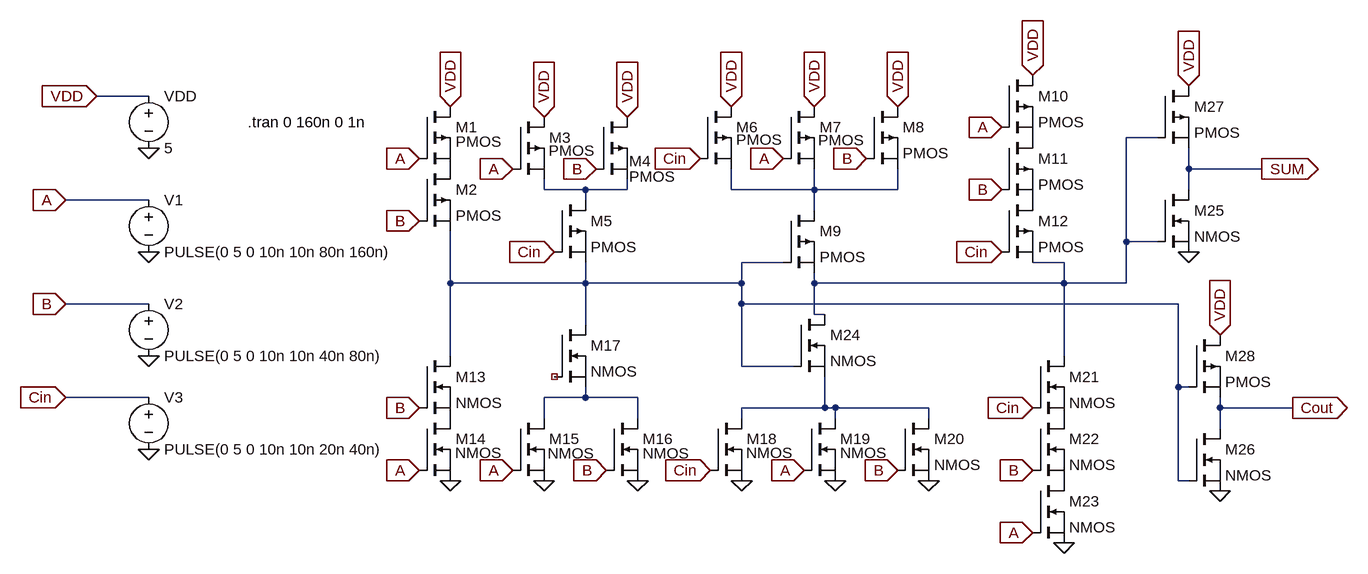
[diagram p0: schematic full add.asc]
full add.asc, the LTspice schematic file:
Version 4.1
SHEET 1 1360 808
WIRE -512 64 -592 64
WIRE 1040 128 992 128
WIRE 1088 176 1088 144
WIRE 1200 176 1088 176
WIRE 96 208 96 192
WIRE 160 208 96 208
WIRE 224 208 224 192
WIRE 224 208 160 208
WIRE 384 208 384 176
WIRE 512 208 512 176
WIRE 512 208 384 208
WIRE 640 208 640 176
WIRE 640 208 512 208
WIRE 1088 208 1088 176
WIRE -512 224 -640 224
WIRE 160 224 160 208
WIRE 512 240 512 208
WIRE 992 288 992 128
WIRE 1040 288 992 288
WIRE 464 320 400 320
WIRE 896 320 848 320
WIRE -48 352 -48 272
WIRE 160 352 160 320
WIRE 160 352 -48 352
WIRE 400 352 400 320
WIRE 400 352 160 352
WIRE 512 352 512 336
WIRE 896 352 896 320
WIRE 896 352 512 352
WIRE 992 352 992 288
WIRE 992 352 896 352
WIRE -512 384 -640 384
WIRE 400 384 400 352
WIRE 1072 384 400 384
WIRE 512 400 512 352
WIRE 528 400 512 400
WIRE 160 416 160 352
WIRE -48 464 -48 352
WIRE 896 464 896 352
WIRE 400 480 400 384
WIRE 480 480 400 480
WIRE 1072 512 1072 384
WIRE 1088 512 1072 512
WIRE -512 528 -640 528
WIRE 160 528 160 512
WIRE 160 528 96 528
WIRE 240 528 160 528
WIRE 528 544 528 496
WIRE 528 544 400 544
WIRE 544 544 528 544
WIRE 688 544 544 544
WIRE 1136 544 1136 528
WIRE 1248 544 1136 544
WIRE 96 560 96 528
WIRE 240 560 240 528
WIRE 400 560 400 544
WIRE 544 560 544 544
WIRE 688 560 688 544
WIRE 1136 576 1136 544
WIRE 1072 656 1072 512
WIRE 1088 656 1072 656
FLAG -592 64 VDD
IOPIN -592 64 In
FLAG -48 80 VDD
IOPIN -48 80 In
FLAG 96 96 VDD
IOPIN 96 96 In
FLAG 224 96 VDD
IOPIN 224 96 In
FLAG 384 80 VDD
IOPIN 384 80 In
FLAG 512 80 VDD
IOPIN 512 80 In
FLAG 640 80 VDD
IOPIN 640 80 In
FLAG 848 32 VDD
IOPIN 848 32 In
FLAG -640 224 A
IOPIN -640 224 In
FLAG -96 160 A
IOPIN -96 160 In
FLAG 48 176 A
IOPIN 48 176 In
FLAG 800 112 A
IOPIN 800 112 In
FLAG 464 160 A
IOPIN 464 160 In
FLAG -96 640 A
IOPIN -96 640 In
FLAG 48 640 A
IOPIN 48 640 In
FLAG 496 640 A
IOPIN 496 640 In
FLAG 848 736 A
IOPIN 848 736 In
FLAG -640 384 B
IOPIN -640 384 In
FLAG -96 256 B
IOPIN -96 256 In
FLAG -96 544 B
IOPIN -96 544 In
FLAG 176 176 B
IOPIN 176 176 In
FLAG 592 160 B
IOPIN 592 160 In
FLAG 800 208 B
IOPIN 800 208 In
FLAG 848 640 B
IOPIN 848 640 In
FLAG 640 640 B
IOPIN 640 640 In
FLAG 192 640 B
IOPIN 192 640 In
FLAG -640 528 Cin
IOPIN -640 528 In
FLAG 336 160 Cin
IOPIN 336 160 In
FLAG 800 304 Cin
IOPIN 800 304 In
FLAG 112 304 Cin
IOPIN 112 304 In
FLAG 352 640 Cin
IOPIN 352 640 In
FLAG 848 544 Cin
IOPIN 848 544 In
FLAG 1200 176 SUM
IOPIN 1200 176 Out
FLAG 1248 544 Cout
IOPIN 1248 544 Out
FLAG -512 144 0
FLAG -512 304 0
FLAG -512 464 0
FLAG -512 608 0
FLAG -48 656 0
FLAG 96 656 0
FLAG 240 656 0
FLAG 400 656 0
FLAG 544 656 0
FLAG 688 656 0
FLAG 896 752 0
FLAG 1088 304 0
FLAG 1136 672 0
FLAG 1088 48 VDD
IOPIN 1088 48 In
FLAG 1136 432 VDD
IOPIN 1136 432 In
SYMBOL pmos -96 80 R0
WINDOW 3 56 54 Left 2
SYMATTR InstName M1
SYMBOL pmos -96 176 R0
SYMATTR InstName M2
SYMBOL pmos 48 96 R0
WINDOW 3 55 52 Left 2
SYMATTR InstName M3
SYMBOL pmos 176 96 R0
WINDOW 0 51 68 Left 2
WINDOW 3 51 92 Left 2
SYMATTR InstName M4
SYMBOL pmos 112 224 R0
SYMATTR InstName M5
SYMBOL pmos 336 80 R0
WINDOW 3 56 51 Left 2
SYMATTR InstName M6
SYMBOL pmos 464 80 R0
WINDOW 3 54 52 Left 2
SYMATTR InstName M7
SYMBOL pmos 592 80 R0
SYMATTR InstName M8
SYMBOL pmos 464 240 R0
SYMATTR InstName M9
SYMBOL pmos 800 32 R0
SYMATTR InstName M10
SYMBOL pmos 800 128 R0
SYMATTR InstName M11
SYMBOL pmos 800 224 R0
SYMATTR InstName M12
SYMBOL nmos -96 464 R0
SYMATTR InstName M13
SYMBOL nmos -96 560 R0
WINDOW 3 55 53 Left 2
SYMATTR InstName M14
SYMBOL nmos 48 560 R0
WINDOW 3 54 54 Left 2
SYMATTR InstName M15
SYMBOL nmos 192 560 R0
WINDOW 3 56 54 Left 2
SYMATTR InstName M16
SYMBOL nmos 112 416 R0
SYMATTR InstName M17
SYMBOL nmos 352 560 R0
WINDOW 3 55 53 Left 2
SYMATTR InstName M18
SYMBOL nmos 496 560 R0
WINDOW 3 56 53 Left 2
SYMATTR InstName M19
SYMBOL nmos 640 560 R0
SYMATTR InstName M20
SYMBOL nmos 848 464 R0
SYMATTR InstName M21
SYMBOL nmos 848 560 R0
SYMATTR InstName M22
SYMBOL nmos 848 656 R0
SYMATTR InstName M23
SYMBOL nmos 480 400 R0
SYMATTR InstName M24
SYMBOL voltage -512 48 R0
WINDOW 123 0 0 Left 0
WINDOW 39 0 0 Left 0
SYMATTR InstName VDD
SYMATTR Value 5
SYMBOL voltage -512 208 R0
WINDOW 123 0 0 Left 0
WINDOW 39 0 0 Left 0
SYMATTR InstName V1
SYMATTR Value PULSE(0 5 0 10n 10n 80n 160n)
SYMBOL voltage -512 368 R0
WINDOW 123 0 0 Left 0
WINDOW 39 0 0 Left 0
SYMATTR InstName V2
SYMATTR Value PULSE(0 5 0 10n 10n 40n 80n)
SYMBOL voltage -512 512 R0
WINDOW 123 0 0 Left 0
WINDOW 39 0 0 Left 0
SYMATTR InstName V3
SYMATTR Value PULSE(0 5 0 10n 10n 20n 40n)
SYMBOL nmos 1040 208 R0
SYMATTR InstName M25
SYMBOL nmos 1088 576 R0
SYMATTR InstName M26
SYMBOL pmos 1040 48 R0
SYMATTR InstName M27
SYMBOL pmos 1088 432 R0
SYMATTR InstName M28
TEXT -360 104 Left 2 !.tran 0 160n 0 1n

The netlist it stands for:
* full add.asc
M1 VDD A P001 P001 PMOS
M2 P001 B N004 N004 PMOS
M3 VDD A N002 N002 PMOS
M4 VDD B N002 N002 PMOS
M5 N002 Cin N004 N004 PMOS
M6 VDD Cin N003 N003 PMOS
M7 VDD A N003 N003 PMOS
M8 VDD B N003 N003 PMOS
M9 N003 N004 N001 N001 PMOS
M10 VDD A P002 P002 PMOS
M11 P002 B P003 P003 PMOS
M12 P003 Cin N001 N001 PMOS
M13 N004 B P004 P004 NMOS
M14 P004 A 0 0 NMOS
M15 N005 A 0 0 NMOS
M16 N005 B 0 0 NMOS
M17 N004 NC_01 N005 N005 NMOS
M18 N006 Cin 0 0 NMOS
M19 N006 A 0 0 NMOS
M20 N006 B 0 0 NMOS
M21 N001 Cin P005 P005 NMOS
M22 P005 B P006 P006 NMOS
M23 P006 A 0 0 NMOS
M24 N001 N004 N006 N006 NMOS
VDD VDD 0 5
V1 A 0 PULSE(0 5 0 10n 10n 80n 160n)
V2 B 0 PULSE(0 5 0 10n 10n 40n 80n)
V3 Cin 0 PULSE(0 5 0 10n 10n 20n 40n)
M25 SUM N001 0 0 NMOS
M26 Cout N004 0 0 NMOS
M27 VDD N001 SUM SUM PMOS
M28 VDD N004 Cout Cout PMOS
.model NMOS NMOS
.model PMOS PMOS
.lib standard.mos
.tran 0 160n 0 1n
.backanno
.end